# Altium schematic sheet SensorBoardPower.SchDoc
size A4
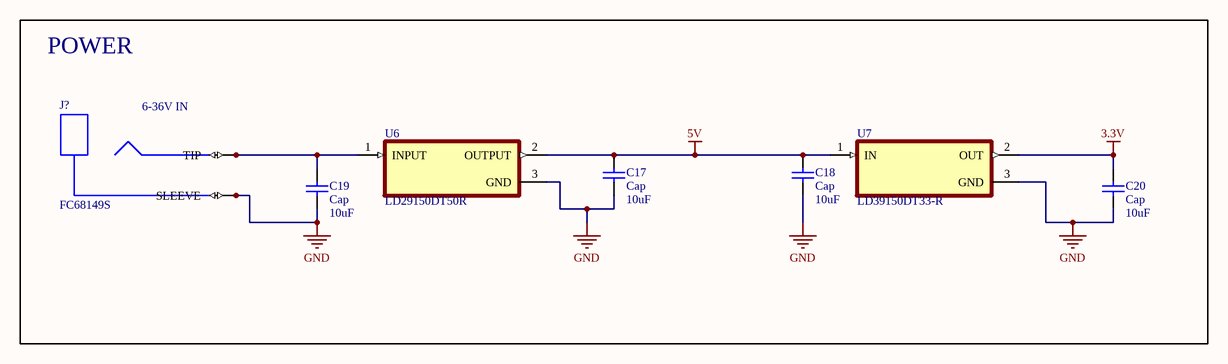
[diagram p0: SensorBoardPower.SchDoc]

## Parts
C17  Cap  value 10uF  [1608[0603]]
C18  Cap  value 10uF  [1608[0603]]
C19  Cap  value 10uF  [1608[0603]]
C20  Cap  value 10uF  [1608[0603]]
J?  FC68149S  [SMT_5.5/2.5_JACK]
U6  LD29150DT50R  [VREG_L7805CDT-TR]
U7  LD39150DT33-R  [VREG_L7805CDT-TR]

## Nets
3.3V: C20.2 U7.2(OUT)
5V: C17.2 C18.2 U6.2(OUTPUT) U7.1(IN)
GND: C17.1 C18.1 C19.1 C20.1 J?.P$1(SLEEVE) J?.P$2(SLEEVE) U6.3(GND) U7.3(GND)
NetC19_2: C19.2 J?.P$3(TIP) J?.P$4(TIP) U6.1(INPUT)

## Notes on the sheet
- POWER
- (near J?) 6-36V IN

## Library data of the parts
C17-C20 = Cap: Capacitor; Published: 8-Jun-2000; LatestRevisionDate: 17-Jul-2002; LatestRevisionNote: Re-released for DXP Platform.; PackageReference: RAD-0.3; Publisher: Altium Limited; PackageDescription: Radial Cap, Thru-Hole; 2 Leads; 0.3 in Pin Spacing
J? = FC68149S: MF: {'manufacturer': u'Cliff'}; Value: *; MP: FC68149S; Price: None; Availability: Unavailable; Package: None
U6 = LD29150DT50R: MF: {'manufacturer': u'STMicroelectronics'}; Value: *; MP: LD29150DT50R; Package: None; Availability: Unavailable; Price: None
U7 = LD39150DT33-R: MF: {'manufacturer': u'STMicroelectronics'}; MP: LD39150DT33-R; Package: None; Price: None; Availability: Unavailable; Value: *